# EAGLE design ESP8266_Breakout (EAGLE 7.6.0)
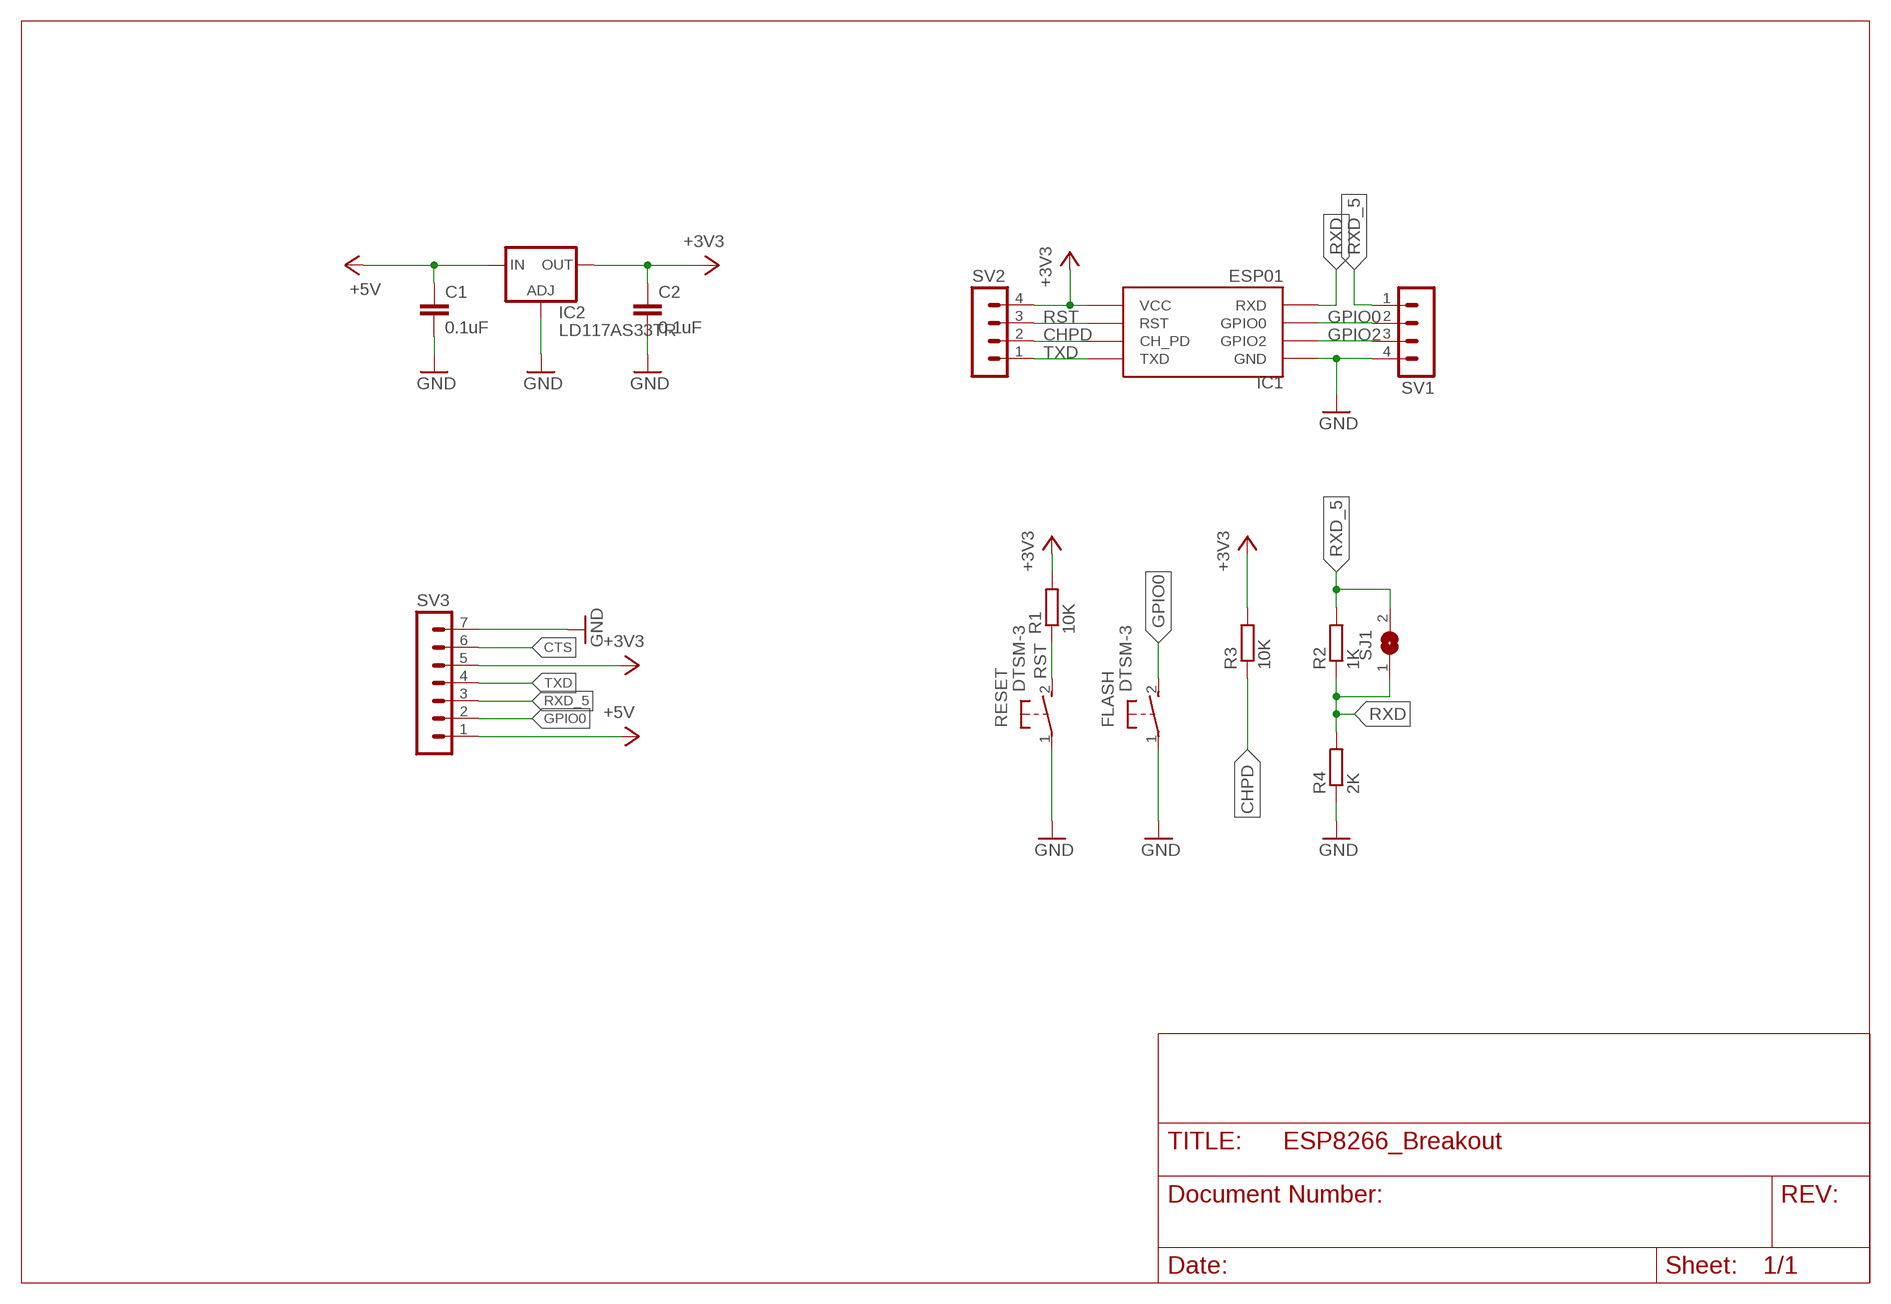
[diagram p0: schematic, sheet 1]

## Parts
C1  0.1uF  C-EUC0805K  [C0805K]
C2  0.1uF  C-EUC0805K  [C0805K]
FLASH  DTSM-3  [DTSM-3]
IC1  ESP01  [ESP01]
IC2  LD117AS33TR  [SOT223]
R1  10K  R-EU_M0805  [M0805]
R2  1K  R-EU_R0805  [R0805]
R3  10K  R-EU_R0805  [R0805]
R4  2K  R-EU_R0805  [R0805]
RESET  DTSM-3  [DTSM-3]
SJ1  SJ  [SJ]
SV1  MA04-1  [MA04-1]
SV2  MA04-1  [MA04-1]
SV3  MA07-1  [MA07-1]

## Nets
+3V3: C2.1 IC1.VCC IC2.4(OUT) R1.2 R3.2 SV2.4 SV3.5
CHPD: IC1.CH_PD R3.1 SV2.2
CTS: SV3.6
GND: C1.2 C2.2 FLASH.1 IC1.GND IC2.1(ADJ) R4.1 RESET.1 SV1.4 SV3.7
GPIO0: FLASH.2 IC1.GPIO0 SV1.2 SV3.2
GPIO2: IC1.GPIO2 SV1.3
RST: IC1.RST R1.1 RESET.2 SV2.3
RXD: IC1.RX(RXD) R2.1 R4.2 SJ1.1
RXD_5: R2.2 SJ1.2 SV1.1 SV3.3
TXD: IC1.TX(TXD) SV2.1 SV3.4
V+: C1.1 IC2.3(IN) SV3.1 ; supply symbol labelled +5V

## Library data of the parts
C1 C2 = rcl:C-EU: CAPACITOR, European symbol
FLASH RESET = switch-tact:DTSM-3
IC1 = esp8266modules:ESP01: ESP8266 Wifi module 01
IC2 = v-reg:LD117A?*: Low drop fixed and adjustable positive voltage regulators 1 A Source: http://www.st.com/stonline/products/literature/ds/7194/ld1117axx.pdf
R1-R4 = rcl:R-EU_: RESISTOR, European symbol
SJ1 = jumper:SJ: SMD solder JUMPER
SV1 SV2 = con-lstb:MA04-1: PIN HEADER; OC_FARNELL: unknown; OC_NEWARK: unknown
SV3 = con-lstb:MA07-1: PIN HEADER; OC_FARNELL: unknown; OC_NEWARK: unknown

## Board
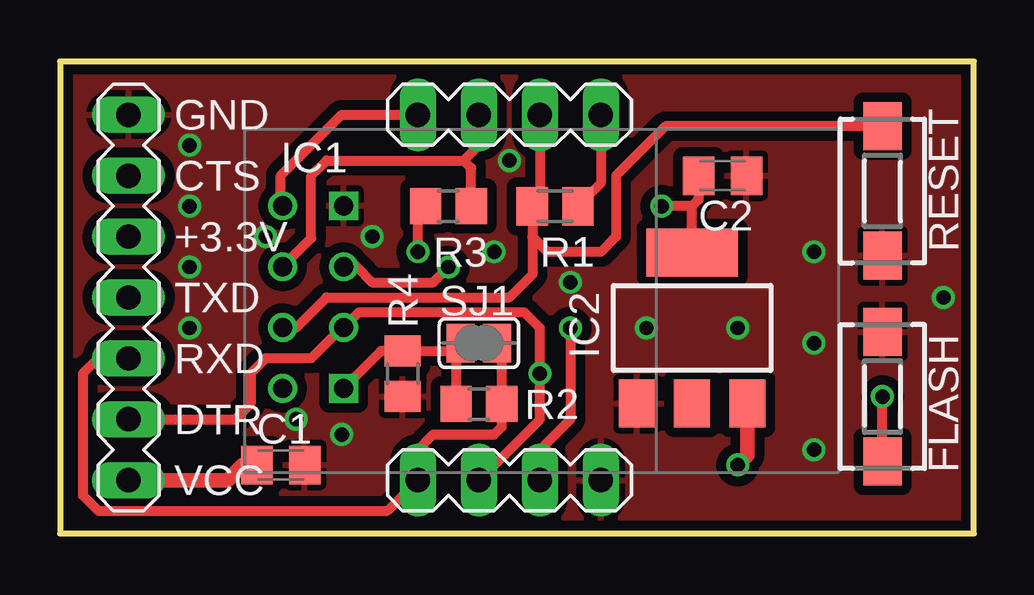
[diagram p1: board, top side]
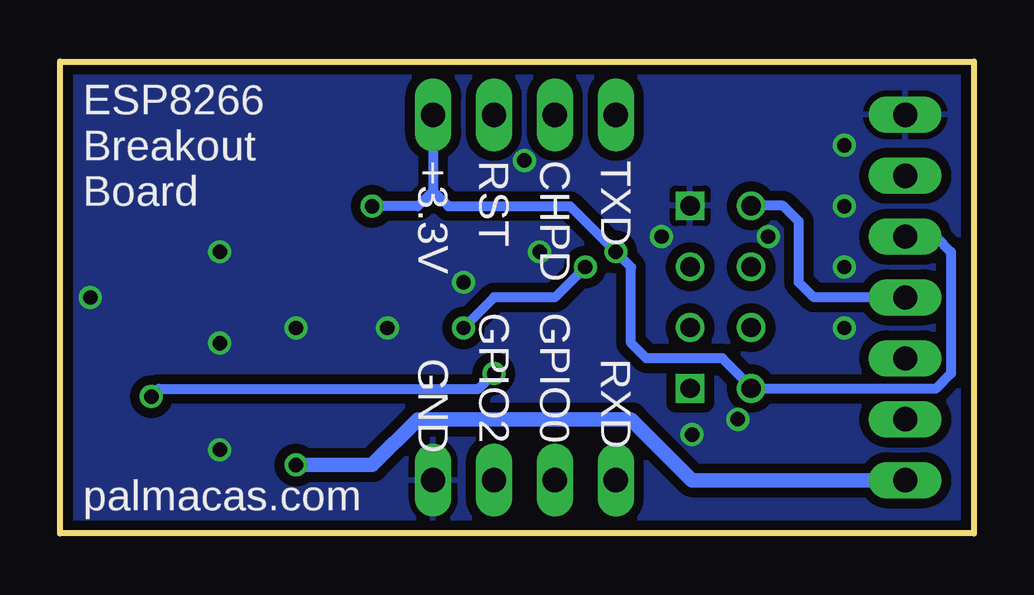
[diagram p2: board, bottom side, seen from below]

Size 38.09 x 19.68 mm. Coordinates in mm from the lower left corner, seen from the top.
Outline: 0,0 38.09,0 38.09,19.68 0,19.68 0,0
Copper layers (1*16): Top 0.0356mm / dielectric 1.5011mm / Bottom 0.0356mm
Design rules "oshpark-2layer": minimum track width 6mil, minimum drill 13mil, track to track 6mil, track to pad 6mil, pad to pad 6mil, via to via 6mil, smd to smd 6mil, copper to edge 15mil, drill to drill 6mil, minimum pad ring 7mil, minimum via ring 7mil, stop-mask expansion 2.5mil, vias tented up to drill 0mil, thermal gap 10mil

### Footprints (pad centres in the part's own frame; a part is rotated, then mirrored left to right if it is on the bottom)
C0805K = smd 1.3 x 1.6: 1 -1,0; 2 1,0
DTSM-3 = smd 2 x 1.6: 1 -2.7,0; 2 2.7,0
ESP01 = drill 0.8: CH_PD -1.285,-8.178; GPIO0 1.255,-5.638; GPIO2 -1.285,-5.638; RST 1.255,-8.178; TX -3.825,-8.178; VCC 3.795,-8.178 | drill 0.8 square: GND -3.825,-5.638; RX 3.795,-5.638
SOT223 = smd 1.5 x 2: 1 -2.3,-3.15; 2 0,-3.15; 3 2.3,-3.15 | smd 3.8 x 2: 4 0,3.15
M0805 = smd 1.3 x 1.6: 1 -0.95,0; 2 0.95,0
R0805 = smd 1.3 x 1.5: 1 -0.95,0; 2 0.95,0
SJ = smd 1.168 x 1.6: 1 -0.762,0; 2 0.762,0
MA04-1 = drill 1.016 long: 1 -3.81,0; 2 -1.27,0; 3 1.27,0; 4 3.81,0
MA07-1 = drill 1.016 long: 1 -7.62,0; 2 -5.08,0; 3 -2.54,0; 4 0,0; 5 2.54,0; 6 5.08,0; 7 7.62,0

### Placement (x,y rotation side)
C1  9.21,2.86 0 top
C2  27.62,14.92 0 top
FLASH  34.29,5.71 270 top
IC1  17.46,9.84 270 top
IC2  26.35,8.57 0 top
R1  20.64,13.65 0 top
R2  17.46,5.4 0 top
R3  16.19,13.65 180 top
R4  14.29,6.67 90 top
RESET  34.29,14.29 90 top
SJ1  17.46,7.94 0 top
SV1  18.73,2.22 0 top
SV2  18.73,17.46 0 top
SV3  2.86,9.84 90 top

### Tracks (layer width: path | path; a pad name or v marks a point on that pad's centre or on a via)
+3V3  (via drill 0.6 pad 0.25)
  Top 0.406: v14.92,11.75 14.92,13.33 R3.2 | SV2.4 22.54,14.61 R1.2 | C2.1 26.62,13.92 26.35,13.65 | 26.35,13.65 v25.08,13.65 | IC2.4 26.35,13.65
  Bottom 0.406: SV3.5 1.59,12.38 0.95,11.75 0.95,6.67 1.59,6.03 9.27,6.03 IC1.VCC 9.29,6.11 10.48,7.3 13.65,7.3 14.29,7.94 14.29,11.11 v14.92,11.75 16.83,13.65 21.91,13.65 22.54,14.29 | SV2.4 22.54,14.29 | 22.54,14.29 23.18,13.65 v25.08,13.65
CHPD
  Top 0.406: IC1.CH_PD 10.48,12.32 10.48,14.92 11.11,15.56 16.83,15.56 | 16.83,15.56 17.46,16.19 SV2.2 | R3.1 17.14,15.24 16.83,15.56
GND  (via drill 0.6 pad 0.25)
  other vias: 11.75,4.13 13.02,12.38 18.73,15.56 5.4,8.57 5.4,13.65 5.4,16.19 9.84,4.76 18.1,11.75 8.57,12.38 31.43,3.49 31.43,7.94 36.83,9.84 24.45,8.57 28.26,8.57 5.4,11.11 21.27,10.48 31.43,11.75
  pour Top (isolate 0.406): 0,0 38.1,0 38.1,19.68 0,19.68
  pour Bottom (isolate 0.406): 0,0 38.1,0 38.1,19.68 0,19.68
GPIO0  (via drill 0.6, 0.6 pad 0.25)
  Top 0.406: SV1.2 20,4.76 v20,6.67 20,8.57 19.37,9.21 12.45,9.21 IC1.GPIO0 11.76,8.59 10.48,7.3 8.57,7.3 7.94,6.67 7.94,5.4 7.3,4.76 SV3.2 | FLASH.2 v34.29,5.71
  Bottom 0.406: v20,6.67 20.64,6.03 33.97,6.03 v34.29,5.71
GPIO2  (via drill 0.6 pad 0.25)
  Top 0.406: IC1.GPIO2 12.37,11.13 13.02,10.48 15.56,10.48 v16.19,11.11 | v21.27,8.57 21.27,4.76 20,3.49 SV1.3
  Bottom 0.406: v16.19,11.11 17.46,9.84 20,9.84 v21.27,8.57
RST
  Top 0.406: SV2.3 20,13.97 R1.1 19.69,12.38 | IC1.RST 9.86,8.59 11.11,9.84 18.73,9.84 19.69,10.8 19.69,12.38 | 19.69,12.38 20.32,11.75 22.54,11.75 23.18,12.38 23.18,14.92 25.24,16.99 RESET.2
RXD
  Top 0.406: 16.83,5.72 R2.1 16.51,7.75 SJ1.1 16.38,7.62 R4.2 13.39,7.62 IC1.RX
RXD_5
  Top 0.406: SJ1.2 18.41,7.75 R2.2 18.41,4.44 18.1,4.13 15.56,4.13 14.92,3.49 SV1.1 13.65,0.95 1.59,0.95 0.95,1.59 0.95,6.67 1.59,7.3 SV3.3
TXD
  Top 0.406: IC1.TX 9.21,13.74 9.21,14.92 11.75,17.46 SV2.1
  Bottom 0.406: SV3.4 6.67,9.84 7.3,10.48 7.3,13.02 7.95,13.67 IC1.TX
V+  (via drill 0.6 pad 0.25)
  Top 0.61: IC2.3 28.65,3.25 v28.26,2.86 | C1.1 7.62,2.86 6.99,2.22 SV3.1
  Bottom 0.61: v28.26,2.86 25.08,2.86 23.18,4.76 14.29,4.76 11.75,2.22 SV3.1

### Text on the board
tPlace: GND | CTS | +3.3V | TXD | RXD | DTR | VCC
bPlace: TXD | CHPD | RST | +3.3V | ESP8266 / Breakout / Board | GPIO0 | GPIO2 | RXD | GND | palmacas.com